# Altium project InputCard.PrjPCB
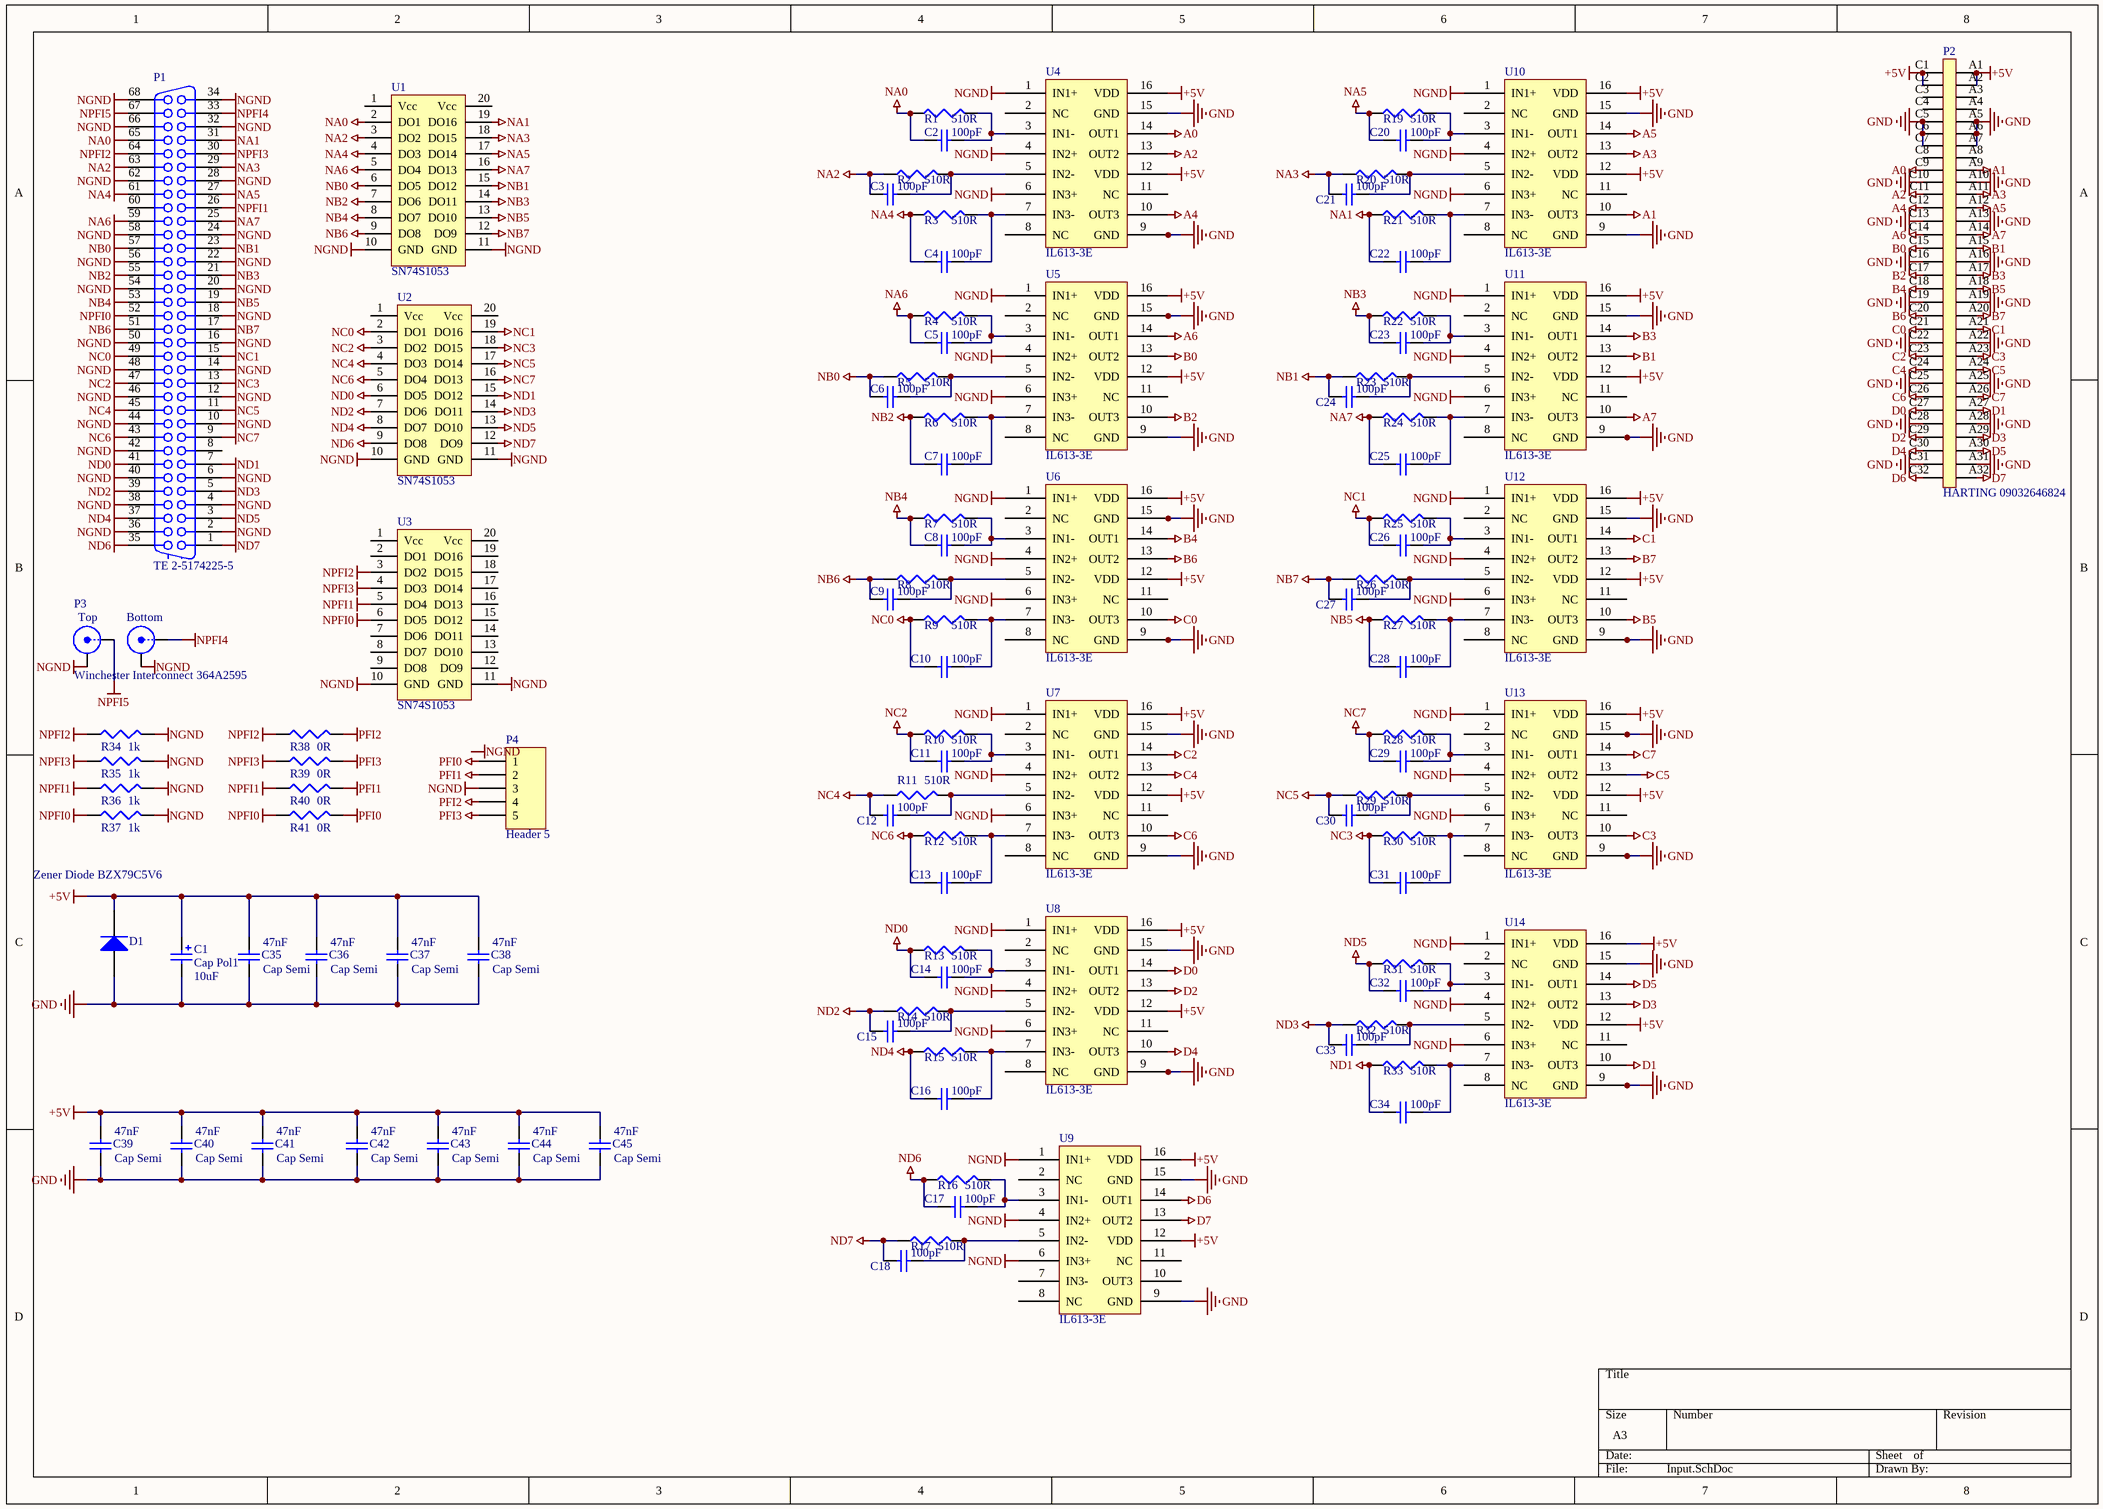
[diagram p0: Input.SchDoc]
1 sheet, 103 parts. Net scope: global (net labels, ports and power ports of the same name join across sheets).
Board file: InputCard.PcbDoc

## Sheet Input.SchDoc
size A3

### Parts
C1  Cap Pol1  value 10uF  [Captantalum]
C2  value 100pF  [0805]  (hidden comment: Cap Semi)
C3  value 100pF  [0805]  (hidden comment: Cap Semi)
C4  value 100pF  [0805]  (hidden comment: Cap Semi)
C5  value 100pF  [0805]  (hidden comment: Cap Semi)
C6  value 100pF  [0805]  (hidden comment: Cap Semi)
C7  value 100pF  [0805]  (hidden comment: Cap Semi)
C8  value 100pF  [0805]  (hidden comment: Cap Semi)
C9  value 100pF  [0805]  (hidden comment: Cap Semi)
C10  value 100pF  [0805]  (hidden comment: Cap Semi)
C11  value 100pF  [0805]  (hidden comment: Cap Semi)
C12  value 100pF  [0805]  (hidden comment: Cap Semi)
C13  value 100pF  [0805]  (hidden comment: Cap Semi)
C14  value 100pF  [0805]  (hidden comment: Cap Semi)
C15  value 100pF  [0805]  (hidden comment: Cap Semi)
C16  value 100pF  [0805]  (hidden comment: Cap Semi)
C17  value 100pF  [0805]  (hidden comment: Cap Semi)
C18  value 100pF  [0805]  (hidden comment: Cap Semi)
C20  value 100pF  [0805]  (hidden comment: Cap Semi)
C21  value 100pF  [0805]  (hidden comment: Cap Semi)
C22  value 100pF  [0805]  (hidden comment: Cap Semi)
C23  value 100pF  [0805]  (hidden comment: Cap Semi)
C24  value 100pF  [0805]  (hidden comment: Cap Semi)
C25  value 100pF  [0805]  (hidden comment: Cap Semi)
C26  value 100pF  [0805]  (hidden comment: Cap Semi)
C27  value 100pF  [0805]  (hidden comment: Cap Semi)
C28  value 100pF  [0805]  (hidden comment: Cap Semi)
C29  value 100pF  [0805]  (hidden comment: Cap Semi)
C30  value 100pF  [0805]  (hidden comment: Cap Semi)
C31  value 100pF  [0805]  (hidden comment: Cap Semi)
C32  value 100pF  [0805]  (hidden comment: Cap Semi)
C33  value 100pF  [0805]  (hidden comment: Cap Semi)
C34  value 100pF  [0805]  (hidden comment: Cap Semi)
C35  Cap Semi  value 47nF  [0805]
C36  Cap Semi  value 47nF  [0805]
C37  Cap Semi  value 47nF  [0805]
C38  Cap Semi  value 47nF  [0805]
C39  Cap Semi  value 47nF  [0805]
C40  Cap Semi  value 47nF  [0805]
C41  Cap Semi  value 47nF  [0805]
C42  Cap Semi  value 47nF  [0805]
C43  Cap Semi  value 47nF  [0805]
C44  Cap Semi  value 47nF  [0805]
C45  Cap Semi  value 47nF  [0805]
D1  Zener Diode BZX79C5V6  [DO-35]
P1  TE 2-5174225-5  [Connector 68 plug]
P2  HARTING 09032646824  [EURO2.54-2H64-NH]
P3  Winchester Interconnect 364A2595  [Double BNC 2]
P4  Header 5  [HDR1X5]
R1  value 510R  [0805]  (hidden comment: Res)
R2  value 510R  [0805]  (hidden comment: Res)
R3  value 510R  [0805]  (hidden comment: Res)
R4  value 510R  [0805]  (hidden comment: Res)
R5  value 510R  [0805]  (hidden comment: Res)
R6  value 510R  [0805]  (hidden comment: Res)
R7  value 510R  [0805]  (hidden comment: Res)
R8  value 510R  [0805]  (hidden comment: Res)
R9  value 510R  [0805]  (hidden comment: Res)
R10  value 510R  [0805]  (hidden comment: Res)
R11  value 510R  [0805]
R12  value 510R  [0805]  (hidden comment: Res)
R13  value 510R  [0805]  (hidden comment: Res)
R14  value 510R  [0805]  (hidden comment: Res)
R15  value 510R  [0805]  (hidden comment: Res)
R16  value 510R  [0805]  (hidden comment: Res)
R17  value 510R  [0805]  (hidden comment: Res)
R19  value 510R  [0805]  (hidden comment: Res)
R20  value 510R  [0805]  (hidden comment: Res)
R21  value 510R  [0805]  (hidden comment: Res)
R22  value 510R  [0805]  (hidden comment: Res)
R23  value 510R  [0805]  (hidden comment: Res)
R24  value 510R  [0805]  (hidden comment: Res)
R25  value 510R  [0805]  (hidden comment: Res)
R26  value 510R  [0805]  (hidden comment: Res)
R27  value 510R  [0805]  (hidden comment: Res)
R28  value 510R  [0805]  (hidden comment: Res)
R29  value 510R  [0805]  (hidden comment: Res)
R30  value 510R  [0805]  (hidden comment: Res)
R31  value 510R  [0805]  (hidden comment: Res)
R32  value 510R  [0805]  (hidden comment: Res)
R33  value 510R  [0805]  (hidden comment: Res)
R34  value 1k  [1206]
R35  value 1k  [1206]
R36  value 1k  [1206]
R37  value 1k  [1206]
R38  value 0R  [1206]
R39  value 0R  [1206]
R40  value 0R  [1206]
R41  value 0R  [1206]
U1  SN74S1053  [DIP-20]
U2  SN74S1053  [DIP-20]
U3  SN74S1053  [DIP-20]
U4  IL613-3E  [R-16_M]
U5  IL613-3E  [R-16_M]
U6  IL613-3E  [R-16_M]
U7  IL613-3E  [R-16_M]
U8  IL613-3E  [R-16_M]
U9  IL613-3E  [R-16_M]
U10  IL613-3E  [R-16_M]
U11  IL613-3E  [R-16_M]
U12  IL613-3E  [R-16_M]
U13  IL613-3E  [R-16_M]
U14  IL613-3E  [R-16_M]

### Nets
+5V: C1.1 C35.1 C36.1 C37.1 C38.1 C39.1 C40.1 C41.1 C42.1 C43.1 C44.1 C45.1 D1.2(K) P2.A1 P2.A2(C33) P2.C1 P2.C2 U4.12(VDD) U4.16(VDD) U5.12(VDD) U5.16(VDD) U6.12(VDD) U6.16(VDD) U7.12(VDD) U7.16(VDD) U8.12(VDD) U8.16(VDD) U9.12(VDD) U9.16(VDD) U10.12(VDD) U10.16(VDD) U11.12(VDD) U11.16(VDD) U12.12(VDD) U12.16(VDD) U13.12(VDD) U13.16(VDD) U14.12(VDD) U14.16(VDD)
A0: P2.C9 U4.14(OUT1)
A1: P2.A9 U10.10(OUT3)
A2: P2.C11 U4.13(OUT2)
A3: P2.A11 U10.13(OUT2)
A4: P2.C12 U4.10(OUT3)
A5: P2.A12 U10.14(OUT1)
A6: P2.C14 U5.14(OUT1)
A7: P2.A14 U11.10(OUT3)
B0: P2.C15 U5.13(OUT2)
B1: P2.A15 U11.13(OUT2)
B2: P2.C17 U5.10(OUT3)
B3: P2.A17 U11.14(OUT1)
B4: P2.C18 U6.14(OUT1)
B5: P2.A18 U12.10(OUT3)
B6: P2.C20 U6.13(OUT2)
B7: P2.A20 U12.13(OUT2)
C0: P2.C21 U6.10(OUT3)
C1: P2.A21 U12.14(OUT1)
C2: P2.C23 U7.14(OUT1)
C3: P2.A23 U13.10(OUT3)
C4: P2.C24 U7.13(OUT2)
C5: P2.A24 U13.13(OUT2)
C6: P2.C26 U7.10(OUT3)
C7: P2.A26 U13.14(OUT1)
D0: P2.C27 U8.14(OUT1)
D1: P2.A27 U14.10(OUT3)
D2: P2.C29 U8.13(OUT2)
D3: P2.A29 U14.13(OUT2)
D4: P2.C30 U8.10(OUT3)
D5: P2.A30 U14.14(OUT1)
D6: P2.C32 U9.14(OUT1)
D7: P2.A32 U9.13(OUT2)
GND: C1.2 C35.2 C36.2 C37.2 C38.2 C39.2 C40.2 C41.2 C42.2 C43.2 C44.2 C45.2 D1.1(A) P2.A5 P2.A6 P2.A7 P2.A10 P2.A13 P2.A16 P2.A19 P2.A22 P2.A25 P2.A28 P2.A31 P2.C5 P2.C6 P2.C7 P2.C10 P2.C13 P2.C16 P2.C19 P2.C22 P2.C25 P2.C28 P2.C31 U4.9(GND) U4.15(GND) U5.9(GND) U5.15(GND) U6.9(GND) U6.15(GND) U7.9(GND) U7.15(GND) U8.9(GND) U8.15(GND) U9.9(GND) U9.15(GND) U10.9(GND) U10.15(GND) U11.9(GND) U11.15(GND) U12.9(GND) U12.15(GND) U13.9(GND) U13.15(GND) U14.9(GND) U14.15(GND)
NA0: C2.1 P1.65 R1.1 U1.2(DO1)
NA1: C22.1 P1.31 R21.1 U1.19(DO16)
NA2: C3.1 P1.63 R2.1 U1.3(DO2)
NA3: C21.1 P1.29 R20.1 U1.18(DO15)
NA4: C4.1 P1.61 R3.1 U1.4(DO3)
NA5: C20.1 P1.27 R19.1 U1.17(DO14)
NA6: C5.1 P1.59 R4.1 U1.5(DO4)
NA7: C25.1 P1.25 R24.1 U1.16(DO13)
NB0: C6.1 P1.57 R5.1 U1.6(DO5)
NB1: C24.1 P1.23 R23.1 U1.15(DO12)
NB2: C7.1 P1.55 R6.1 U1.7(DO6)
NB3: C23.1 P1.21 R22.1 U1.14(DO11)
NB4: C8.1 P1.53 R7.1 U1.8(DO7)
NB5: C28.1 P1.19 R27.1 U1.13(DO10)
NB6: C9.1 P1.51 R8.1 U1.9(DO8)
NB7: C27.1 P1.17 R26.1 U1.12(DO9)
NC0: C10.1 P1.49 R9.1 U2.2(DO1)
NC1: C26.1 P1.15 R25.1 U2.19(DO16)
NC2: C11.1 P1.47 R10.1 U2.3(DO2)
NC3: C31.1 P1.13 R30.1 U2.18(DO15)
NC4: C12.1 P1.45 R11.1 U2.4(DO3)
NC5: C30.1 P1.11 R29.1 U2.17(DO14)
NC6: C13.1 P1.43 R12.1 U2.5(DO4)
NC7: C29.1 P1.9 R28.1 U2.16(DO13)
ND0: C14.1 P1.41 R13.1 U2.6(DO5)
ND1: C34.1 P1.7 R33.1 U2.15(DO12)
ND2: C15.1 P1.39 R14.1 U2.7(DO6)
ND3: C33.1 P1.5 R32.1 U2.14(DO11)
ND4: C16.1 P1.37 R15.1 U2.8(DO7)
ND5: C32.1 P1.3 R31.1 U2.13(DO10)
ND6: C17.1 P1.35 R16.1 U2.9(DO8)
ND7: C18.1 P1.1 R17.1 U2.12(DO9)
NGND: P1.2 P1.4 P1.6 P1.10 P1.12 P1.14 P1.16 P1.18 P1.20 P1.22 P1.24 P1.28 P1.32 P1.34 P1.36 P1.38 P1.40 P1.42 P1.44 P1.46 P1.48 P1.50 P1.54 P1.56 P1.58 P1.62 P1.66 P1.68 P3.1 P3.3 P4.3 R34.2 R35.2 R36.2 R37.2 U1.10(GND) U1.11(GND) U2.10(GND) U2.11(GND) U3.10(GND) U3.11(GND) U4.1(IN1+) U4.4(IN2+) U4.6(IN3+) U5.1(IN1+) U5.4(IN2+) U5.6(IN3+) U6.1(IN1+) U6.4(IN2+) U6.6(IN3+) U7.1(IN1+) U7.4(IN2+) U7.6(IN3+) U8.1(IN1+) U8.4(IN2+) U8.6(IN3+) U9.1(IN1+) U9.4(IN2+) U9.6(IN3+) U10.1(IN1+) U10.4(IN2+) U10.6(IN3+) U11.1(IN1+) U11.4(IN2+) U11.6(IN3+) U12.1(IN1+) U12.4(IN2+) U12.6(IN3+) U13.1(IN1+) U13.4(IN2+) U13.6(IN3+) U14.1(IN1+) U14.4(IN2+) U14.6(IN3+)
NPFI0: P1.52 R37.1 R41.1 U3.6(DO5)
NPFI1: P1.26 R36.1 R40.1 U3.5(DO4)
NPFI2: P1.64 R34.1 R38.1 U3.3(DO2)
NPFI3: P1.30 R35.1 R39.1 U3.4(DO3)
NPFI4: P1.33 P3.4
NPFI5: P1.67 P3.2
PFI0: P4.1 R41.2
PFI1: P4.2 R40.2
PFI2: P4.4 R38.2
PFI3: P4.5 R39.2
NetC2_2: C2.2 R1.2 U4.3(IN1-)
NetC3_2: C3.2 R2.2 U4.5(IN2-)
NetC4_2: C4.2 R3.2 U4.7(IN3-)
NetC5_2: C5.2 R4.2 U5.3(IN1-)
NetC6_2: C6.2 R5.2 U5.5(IN2-)
NetC7_2: C7.2 R6.2 U5.7(IN3-)
NetC8_2: C8.2 R7.2 U6.3(IN1-)
NetC9_2: C9.2 R8.2 U6.5(IN2-)
NetC10_2: C10.2 R9.2 U6.7(IN3-)
NetC11_2: C11.2 R10.2 U7.3(IN1-)
NetC12_2: C12.2 R11.2 U7.5(IN2-)
NetC13_2: C13.2 R12.2 U7.7(IN3-)
NetC14_2: C14.2 R13.2 U8.3(IN1-)
NetC15_2: C15.2 R14.2 U8.5(IN2-)
NetC16_2: C16.2 R15.2 U8.7(IN3-)
NetC17_2: C17.2 R16.2 U9.3(IN1-)
NetC18_2: C18.2 R17.2 U9.5(IN2-)
NetC20_2: C20.2 R19.2 U10.3(IN1-)
NetC21_2: C21.2 R20.2 U10.5(IN2-)
NetC22_2: C22.2 R21.2 U10.7(IN3-)
NetC23_2: C23.2 R22.2 U11.3(IN1-)
NetC24_2: C24.2 R23.2 U11.5(IN2-)
NetC25_2: C25.2 R24.2 U11.7(IN3-)
NetC26_2: C26.2 R25.2 U12.3(IN1-)
NetC27_2: C27.2 R26.2 U12.5(IN2-)
NetC28_2: C28.2 R27.2 U12.7(IN3-)
NetC29_2: C29.2 R28.2 U13.3(IN1-)
NetC30_2: C30.2 R29.2 U13.5(IN2-)
NetC31_2: C31.2 R30.2 U13.7(IN3-)
NetC32_2: C32.2 R31.2 U14.3(IN1-)
NetC33_2: C33.2 R32.2 U14.5(IN2-)
NetC34_2: C34.2 R33.2 U14.7(IN3-)

Not connected (* = marked no-connect by the designer): P1 8 60; P2 A3(C34) A4 A8 C3(3) C4(4) C8(8); U1 1(Vcc) 20(Vcc); U2 1(Vcc) 20(Vcc); U3 1(Vcc) 2(DO1) 7(DO6) 8(DO7) 9(DO8) 12(DO9) 13(DO10) 14(DO11) 15(DO12) 16(DO13) 17(DO14) 18(DO15) 19(DO16) 20(Vcc); U4 2(NC) 8(NC) 11(NC); U5 2(NC) 8(NC) 11(NC); U6 2(NC) 8(NC) 11(NC); U7 2(NC) 8(NC) 11(NC); U8 2(NC) 8(NC) 11(NC); U9 2(NC) 7(IN3-) 8(NC) 10(OUT3) 11(NC); U10 2(NC) 8(NC) 11(NC); U11 2(NC) 8(NC) 11(NC); U12 2(NC) 8(NC) 11(NC); U13 2(NC) 8(NC) 11(NC); U14 2(NC) 8(NC) 11(NC)

### Notes on the sheet
- Labels drawn without touching a wire or pin: NGND
- (in symbol Double BNC New) Top; Bottom

### Library data of the parts
C1 = Cap Pol1: Polarized Capacitor (Radial); Published: 8-Jun-2000; LatestRevisionDate: 17-Jul-2002; LatestRevisionNote: Re-released for DXP Platform.; PackageReference: RB7.6-15; Publisher: Altium Limited; PackageDescription: Polarized Capacitor (Radial); 2 Leads
C2-C18 C20-C45 = Cap Semi: Capacitor (Semiconductor SIM Model); Published: 8-Jun-2000; LatestRevisionDate: 29-May-2009; LatestRevisionNote: IPC-7351 Footprint Added.; PackageReference: C1206; Publisher: Altium Limited; PackageDescription: Chip Capacitor
D1 = Diode 1N914: High Conductance Fast Diode; Published: 8-Jun-2000; LatestRevisionDate: 17-Jul-2002; LatestRevisionNote: Re-released for DXP Platform.; DatasheetVersion: 1997; PackageReference: DO-35; Publisher: Altium Limited; PackageDescription: Diode, Axial; Body 3.8 x 1.9 mm (LxDia. max), Lead Dia. 0.53 mm (max); Code_JEDEC: DO-204-AH; ComponentLink1Description: Manufacturer Link; ComponentLink1URL: http://www.fairchildsemi.com/; ComponentLink2Description: Datasheet; ComponentLink2URL: http://www.fairchildsemi.com/ds/1N%2F1N4448.pdf
P1 = Connector 68: Receptacle Header Assemby; PackageDocument: B; Positions: 68; Published: 15-Jun-2001; LatestRevisionDate: 17-Jul-2002; LatestRevisionNote: Re-released for DXP Platform.; DatasheetDocument: 1-Oct-1983; PackageReference: 178240-8; Publisher: Altium Limited; Orientation: Right Angle
P2 = Din 41612 64NH: Din 41612
P3 = Double BNC New: Double BNC Elbow Connector; LatestRevisionDate: 17-Jul-2002; LatestRevisionNote: Re-released for DXP Platform.; Publisher: Altium Limited
P4 = Header 5: Header, 5-Pin; LatestRevisionDate: 17-Jul-2002; LatestRevisionNote: Re-released for DXP Platform.; Publisher: Altium Limited
R1-R10 R12-R17 R19-R33 = Res_SM: Resistor; Published: 8-Jun-2000; LatestRevisionDate: 29-May-2009; LatestRevisionNote: IPC-7351 Footprint Added.; PackageReference: J1-0603; Publisher: Altium Limited; PackageDescription: Chip Resistor
R11 R34-R41 = Res3: Resistor; Published: 8-Jun-2000; LatestRevisionDate: 29-May-2009; LatestRevisionNote: IPC-7351 Footprint Added.; PackageReference: J1-0603; Publisher: Altium Limited; PackageDescription: Chip Resistor